# EAGLE design 2layer_v1 (EAGLE 9.2.2)
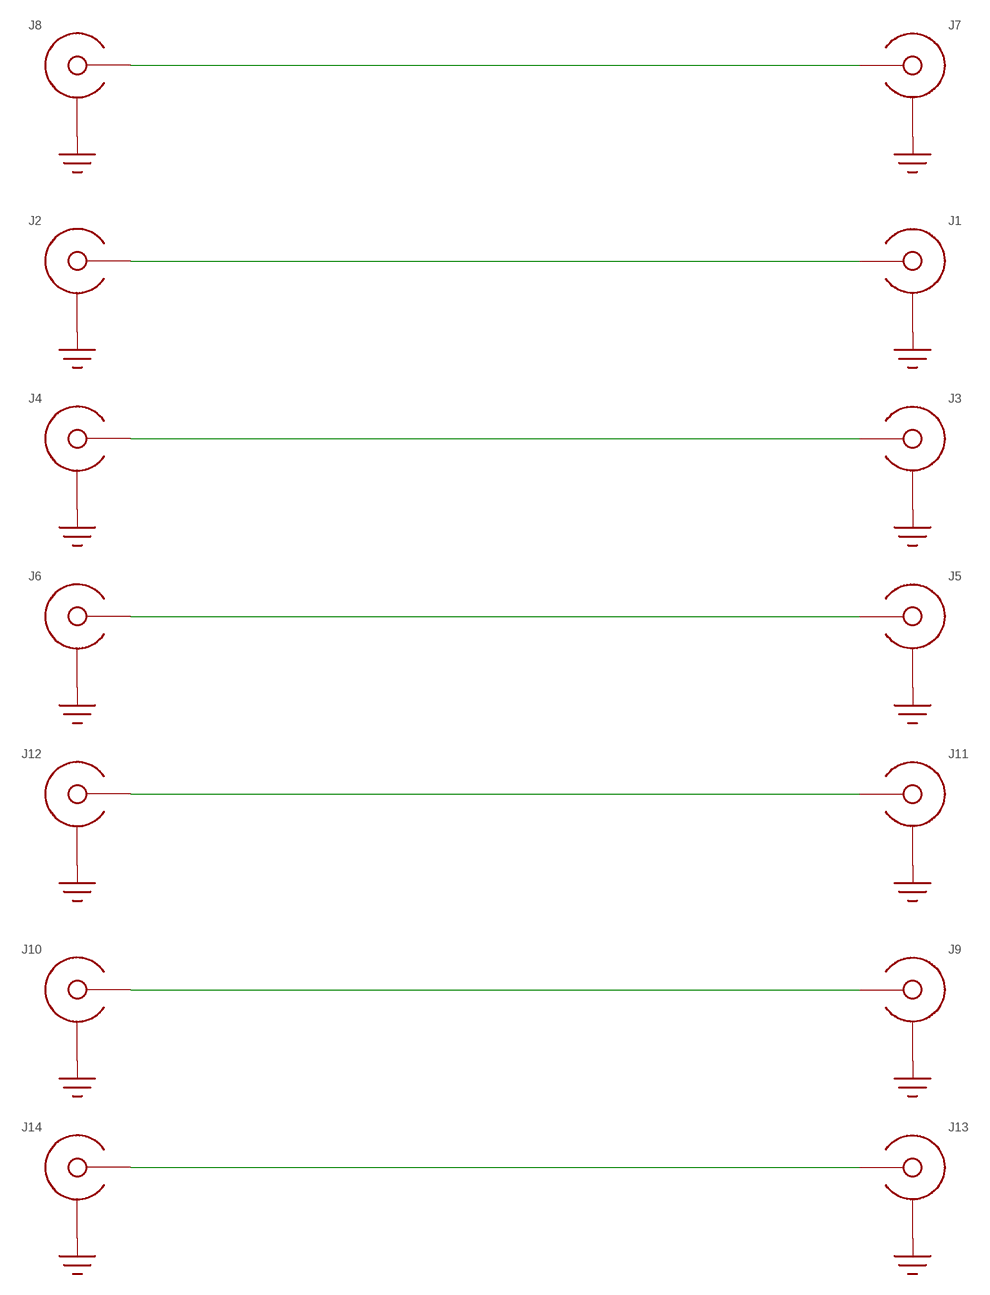
[diagram p0: schematic, sheet 1]

## Parts
J1  SMA_END_LAUNCH2L  [SMA_EDGE_LAUNCH_2L]
J2  SMA_END_LAUNCH2L  [SMA_EDGE_LAUNCH_2L]
J3  SMA_END_LAUNCH2L  [SMA_EDGE_LAUNCH_2L]
J4  SMA_END_LAUNCH2L  [SMA_EDGE_LAUNCH_2L]
J5  SMA_END_LAUNCH2L  [SMA_EDGE_LAUNCH_2L]
J6  SMA_END_LAUNCH2L  [SMA_EDGE_LAUNCH_2L]
J7  SMA_END_LAUNCH2L  [SMA_EDGE_LAUNCH_2L]
J8  SMA_END_LAUNCH2L  [SMA_EDGE_LAUNCH_2L]
J9  SMA_END_LAUNCH2L  [SMA_EDGE_LAUNCH_2L]
J10  SMA_END_LAUNCH2L  [SMA_EDGE_LAUNCH_2L]
J11  SMA_END_LAUNCH2L  [SMA_EDGE_LAUNCH_2L]
J12  SMA_END_LAUNCH2L  [SMA_EDGE_LAUNCH_2L]
J13  SMA_END_LAUNCH2L  [SMA_EDGE_LAUNCH_2L]
J14  SMA_END_LAUNCH2L  [SMA_EDGE_LAUNCH_2L]

## Nets
GND: J1.BOTTOM_GND(SHIELD) J1.GND@1(SHIELD) J1.GND@2(SHIELD) J1.GND@3(SHIELD) J1.GND@4(SHIELD) J1.GND@5(SHIELD) J1.GND@6(SHIELD) J1.GND@7(SHIELD) J1.GND@8(SHIELD) J1.GND@11(SHIELD) J1.GND@12(SHIELD) J1.GND@14(SHIELD) J1.GND@15(SHIELD) J1.GND@16(SHIELD) J1.GND@17(SHIELD) J1.GND_PAD1(SHIELD) J1.GND_PAD2(SHIELD) J2.BOTTOM_GND(SHIELD) J2.GND@1(SHIELD) J2.GND@2(SHIELD) J2.GND@3(SHIELD) J2.GND@4(SHIELD) J2.GND@5(SHIELD) J2.GND@6(SHIELD) J2.GND@7(SHIELD) J2.GND@8(SHIELD) J2.GND@11(SHIELD) J2.GND@12(SHIELD) J2.GND@14(SHIELD) J2.GND@15(SHIELD) J2.GND@16(SHIELD) J2.GND@17(SHIELD) J2.GND_PAD1(SHIELD) J2.GND_PAD2(SHIELD) J3.BOTTOM_GND(SHIELD) J3.GND@1(SHIELD) J3.GND@2(SHIELD) J3.GND@3(SHIELD) J3.GND@4(SHIELD) J3.GND@5(SHIELD) J3.GND@6(SHIELD) J3.GND@7(SHIELD) J3.GND@8(SHIELD) J3.GND@11(SHIELD) J3.GND@12(SHIELD) J3.GND@14(SHIELD) J3.GND@15(SHIELD) J3.GND@16(SHIELD) J3.GND@17(SHIELD) J3.GND_PAD1(SHIELD) J3.GND_PAD2(SHIELD) J4.BOTTOM_GND(SHIELD) J4.GND@1(SHIELD) J4.GND@2(SHIELD) J4.GND@3(SHIELD) J4.GND@4(SHIELD) J4.GND@5(SHIELD) J4.GND@6(SHIELD) J4.GND@7(SHIELD) J4.GND@8(SHIELD) J4.GND@11(SHIELD) J4.GND@12(SHIELD) J4.GND@14(SHIELD) J4.GND@15(SHIELD) J4.GND@16(SHIELD) J4.GND@17(SHIELD) J4.GND_PAD1(SHIELD) J4.GND_PAD2(SHIELD) J5.BOTTOM_GND(SHIELD) J5.GND@1(SHIELD) J5.GND@2(SHIELD) J5.GND@3(SHIELD) J5.GND@4(SHIELD) J5.GND@5(SHIELD) J5.GND@6(SHIELD) J5.GND@7(SHIELD) J5.GND@8(SHIELD) J5.GND@11(SHIELD) J5.GND@12(SHIELD) J5.GND@14(SHIELD) J5.GND@15(SHIELD) J5.GND@16(SHIELD) J5.GND@17(SHIELD) J5.GND_PAD1(SHIELD) J5.GND_PAD2(SHIELD) J6.BOTTOM_GND(SHIELD) J6.GND@1(SHIELD) J6.GND@2(SHIELD) J6.GND@3(SHIELD) J6.GND@4(SHIELD) J6.GND@5(SHIELD) J6.GND@6(SHIELD) J6.GND@7(SHIELD) J6.GND@8(SHIELD) J6.GND@11(SHIELD) J6.GND@12(SHIELD) J6.GND@14(SHIELD) J6.GND@15(SHIELD) J6.GND@16(SHIELD) J6.GND@17(SHIELD) J6.GND_PAD1(SHIELD) J6.GND_PAD2(SHIELD) J7.BOTTOM_GND(SHIELD) J7.GND@1(SHIELD) J7.GND@2(SHIELD) J7.GND@3(SHIELD) J7.GND@4(SHIELD) J7.GND@5(SHIELD) J7.GND@6(SHIELD) J7.GND@7(SHIELD) J7.GND@8(SHIELD) J7.GND@11(SHIELD) J7.GND@12(SHIELD) J7.GND@14(SHIELD) J7.GND@15(SHIELD) J7.GND@16(SHIELD) J7.GND@17(SHIELD) J7.GND_PAD1(SHIELD) J7.GND_PAD2(SHIELD) J8.BOTTOM_GND(SHIELD) J8.GND@1(SHIELD) J8.GND@2(SHIELD) J8.GND@3(SHIELD) J8.GND@4(SHIELD) J8.GND@5(SHIELD) J8.GND@6(SHIELD) J8.GND@7(SHIELD) J8.GND@8(SHIELD) J8.GND@11(SHIELD) J8.GND@12(SHIELD) J8.GND@14(SHIELD) J8.GND@15(SHIELD) J8.GND@16(SHIELD) J8.GND@17(SHIELD) J8.GND_PAD1(SHIELD) J8.GND_PAD2(SHIELD) J9.BOTTOM_GND(SHIELD) J9.GND@1(SHIELD) J9.GND@2(SHIELD) J9.GND@3(SHIELD) J9.GND@4(SHIELD) J9.GND@5(SHIELD) J9.GND@6(SHIELD) J9.GND@7(SHIELD) J9.GND@8(SHIELD) J9.GND@11(SHIELD) J9.GND@12(SHIELD) J9.GND@14(SHIELD) J9.GND@15(SHIELD) J9.GND@16(SHIELD) J9.GND@17(SHIELD) J9.GND_PAD1(SHIELD) J9.GND_PAD2(SHIELD) J10.BOTTOM_GND(SHIELD) J10.GND@1(SHIELD) J10.GND@2(SHIELD) J10.GND@3(SHIELD) J10.GND@4(SHIELD) J10.GND@5(SHIELD) J10.GND@6(SHIELD) J10.GND@7(SHIELD) J10.GND@8(SHIELD) J10.GND@11(SHIELD) J10.GND@12(SHIELD) J10.GND@14(SHIELD) J10.GND@15(SHIELD) J10.GND@16(SHIELD) J10.GND@17(SHIELD) J10.GND_PAD1(SHIELD) J10.GND_PAD2(SHIELD) J11.BOTTOM_GND(SHIELD) J11.GND@1(SHIELD) J11.GND@2(SHIELD) J11.GND@3(SHIELD) J11.GND@4(SHIELD) J11.GND@5(SHIELD) J11.GND@6(SHIELD) J11.GND@7(SHIELD) J11.GND@8(SHIELD) J11.GND@11(SHIELD) J11.GND@12(SHIELD) J11.GND@14(SHIELD) J11.GND@15(SHIELD) J11.GND@16(SHIELD) J11.GND@17(SHIELD) J11.GND_PAD1(SHIELD) J11.GND_PAD2(SHIELD) J12.BOTTOM_GND(SHIELD) J12.GND@1(SHIELD) J12.GND@2(SHIELD) J12.GND@3(SHIELD) J12.GND@4(SHIELD) J12.GND@5(SHIELD) J12.GND@6(SHIELD) J12.GND@7(SHIELD) J12.GND@8(SHIELD) J12.GND@11(SHIELD) J12.GND@12(SHIELD) J12.GND@14(SHIELD) J12.GND@15(SHIELD) J12.GND@16(SHIELD) J12.GND@17(SHIELD) J12.GND_PAD1(SHIELD) J12.GND_PAD2(SHIELD) J13.BOTTOM_GND(SHIELD) J13.GND@1(SHIELD) J13.GND@2(SHIELD) J13.GND@3(SHIELD) J13.GND@4(SHIELD) J13.GND@5(SHIELD) J13.GND@6(SHIELD) J13.GND@7(SHIELD) J13.GND@8(SHIELD) J13.GND@11(SHIELD) J13.GND@12(SHIELD) J13.GND@14(SHIELD) J13.GND@15(SHIELD) J13.GND@16(SHIELD) J13.GND@17(SHIELD) J13.GND_PAD1(SHIELD) J13.GND_PAD2(SHIELD) J14.BOTTOM_GND(SHIELD) J14.GND@1(SHIELD) J14.GND@2(SHIELD) J14.GND@3(SHIELD) J14.GND@4(SHIELD) J14.GND@5(SHIELD) J14.GND@6(SHIELD) J14.GND@7(SHIELD) J14.GND@8(SHIELD) J14.GND@11(SHIELD) J14.GND@12(SHIELD) J14.GND@14(SHIELD) J14.GND@15(SHIELD) J14.GND@16(SHIELD) J14.GND@17(SHIELD) J14.GND_PAD1(SHIELD) J14.GND_PAD2(SHIELD)
N$1: J1.CENTER@1(CENTER) J2.CENTER@1(CENTER)
N$2: J3.CENTER@1(CENTER) J4.CENTER@1(CENTER)
N$3 [41-8]: J5.CENTER@1(CENTER) J6.CENTER@1(CENTER)
N$4 [41-8]: J7.CENTER@1(CENTER) J8.CENTER@1(CENTER)
N$5 [32-6]: J9.CENTER@1(CENTER) J10.CENTER@1(CENTER)
N$6 [32-6]: J11.CENTER@1(CENTER) J12.CENTER@1(CENTER)
N$7 [41-8]: J13.CENTER@1(CENTER) J14.CENTER@1(CENTER)

## Library data of the parts
J1-J14 = yapo:SMA_END_LAUNCH

## Net classes
1 41-8: width 1.041 mm, clearance 0.203 mm
2 32-6: width 0.813 mm, clearance 0.152 mm
3 misc-8: clearance 0.203 mm

## Board
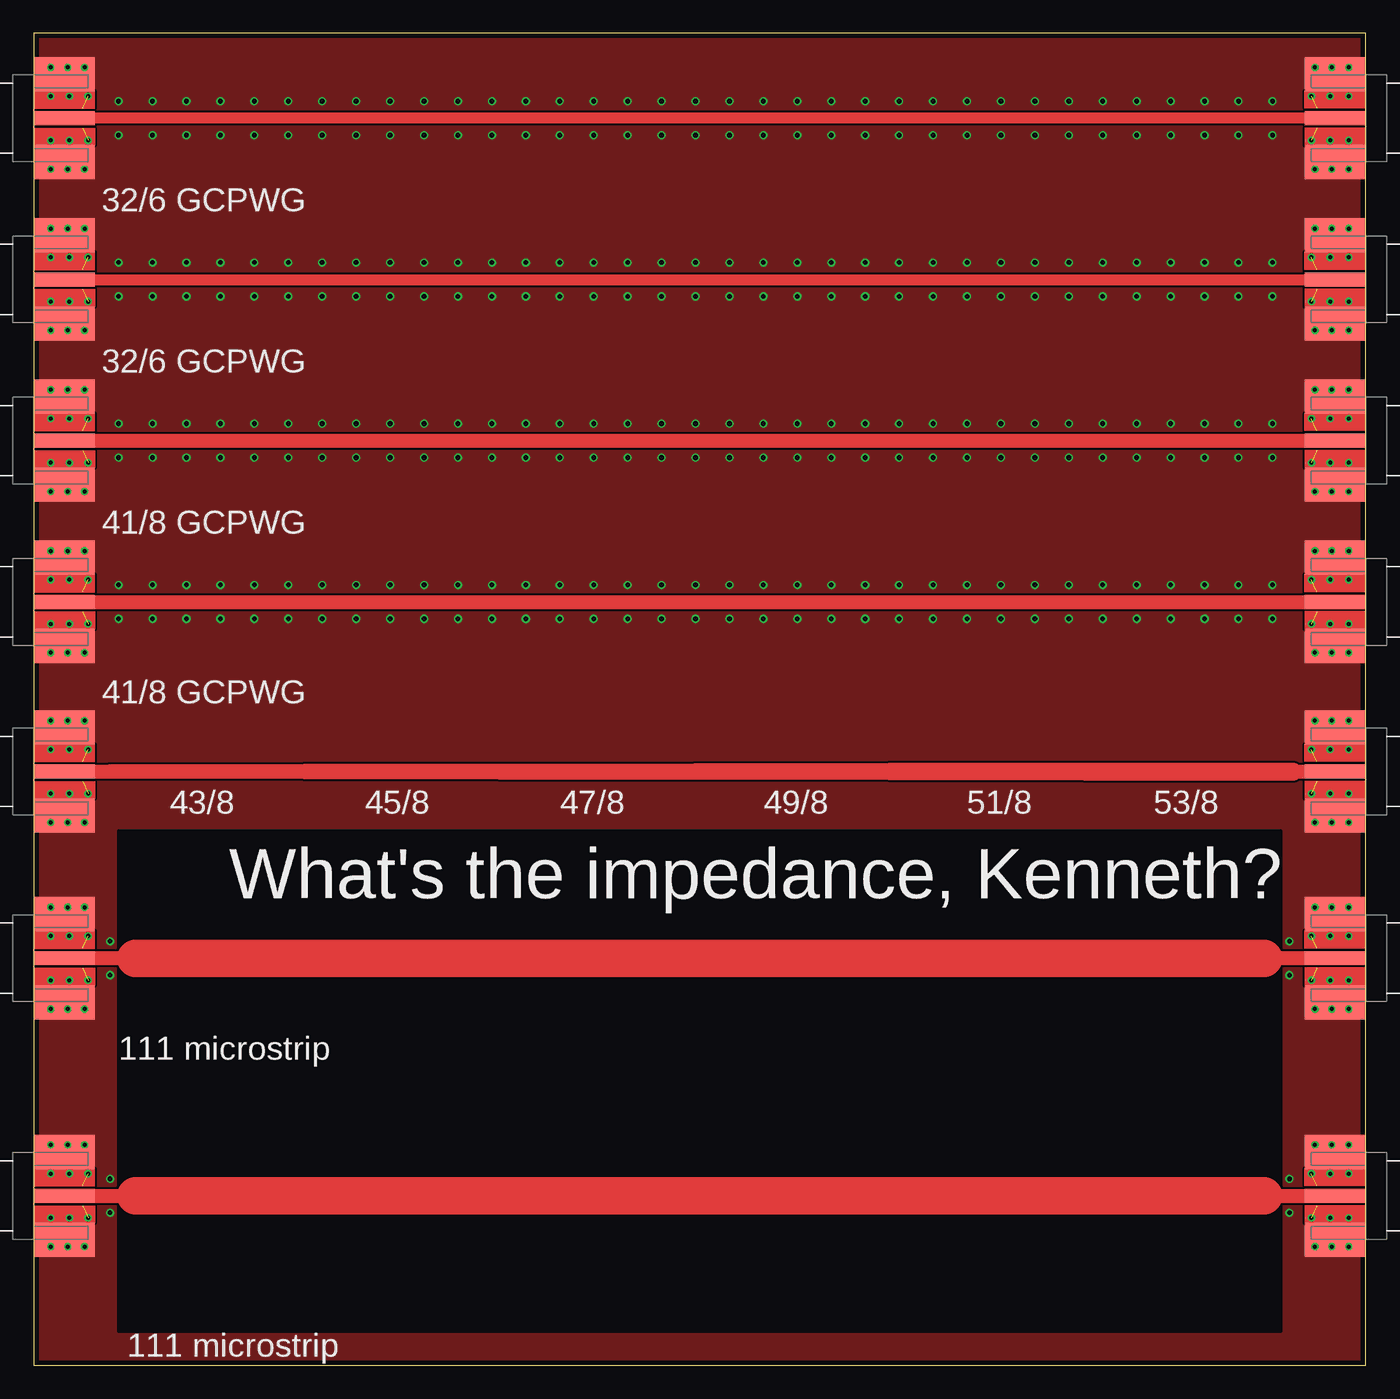
[diagram p1: board, top side]
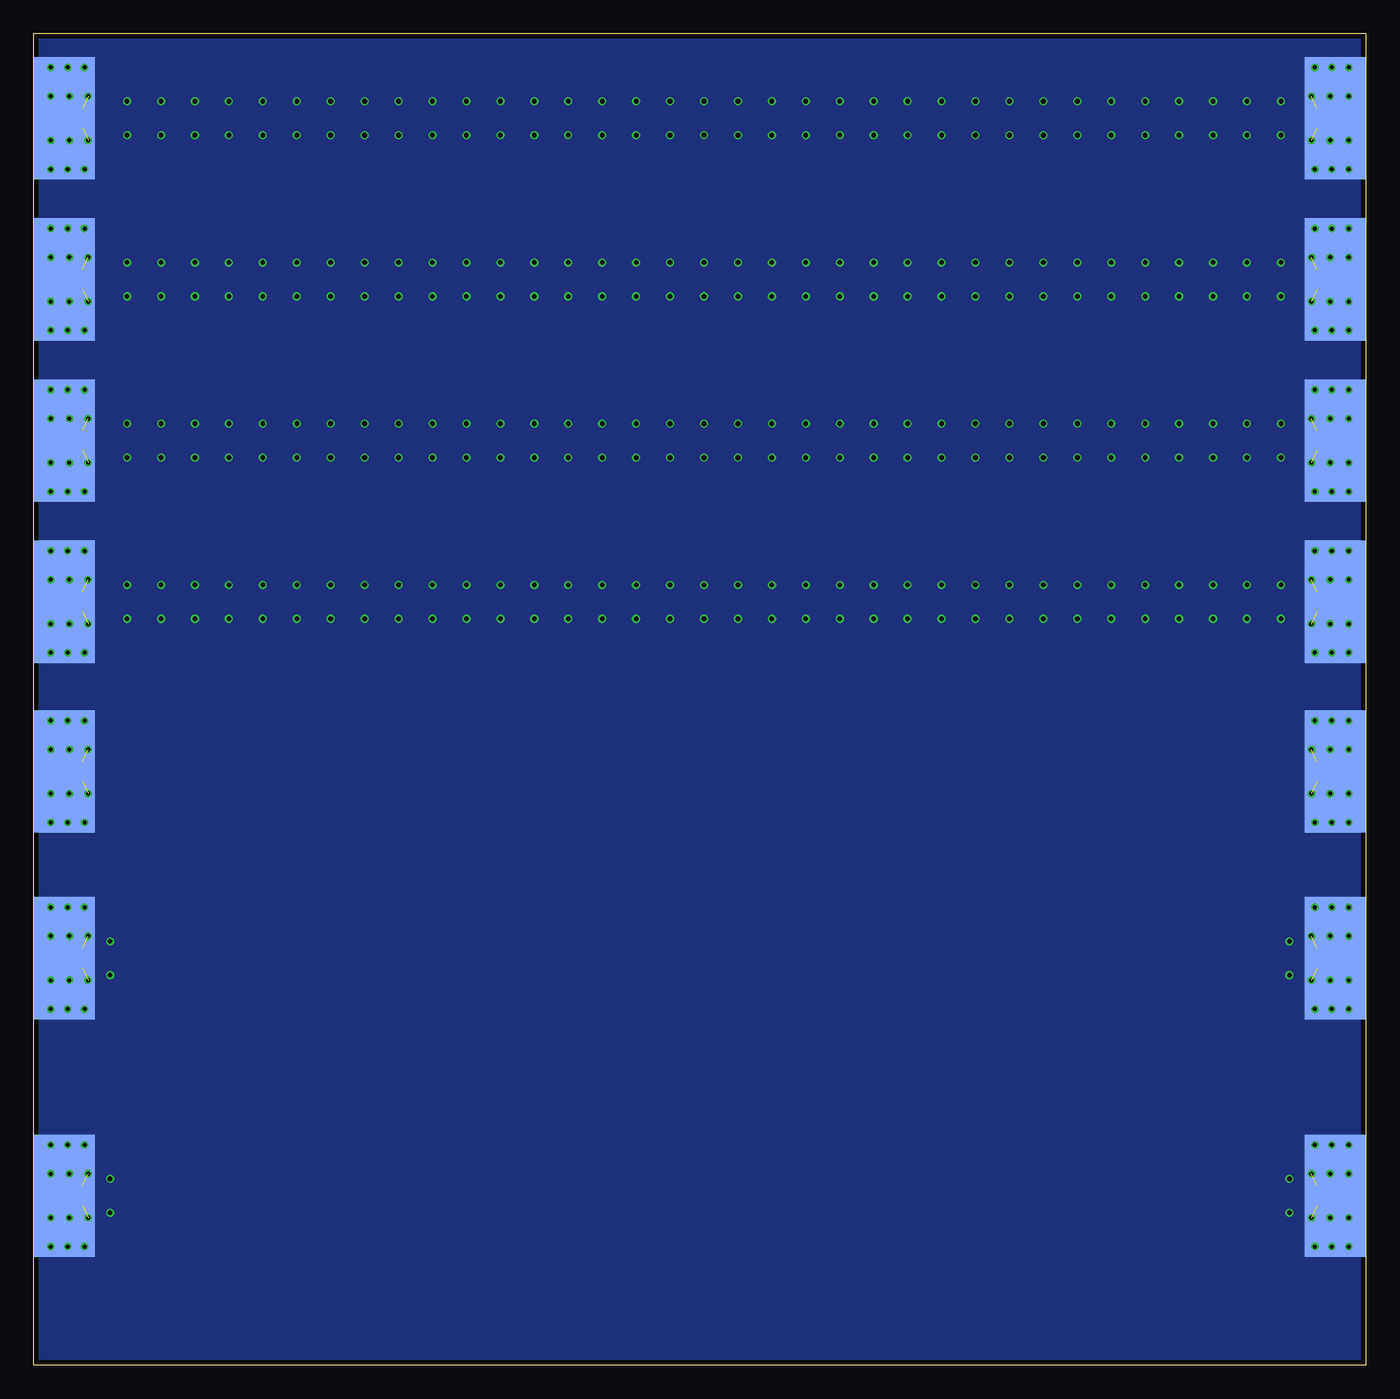
[diagram p2: board, bottom side, seen from below]

Size 99.69 x 99.69 mm. Coordinates in mm from the lower left corner, seen from the top.
Outline: 0,0 99.69,0 99.69,99.69 0,99.69 0,0
Copper layers (1*16): Top 0.035559375mm / dielectric 1.6mm / Bottom 0.035559375mm
Design rules "oshpark-2layer": minimum track width 6mil, minimum drill 10mil, track to track 6mil, track to pad 6mil, pad to pad 6mil, via to via 6mil, smd to smd 6mil, copper to edge 15mil, drill to drill 6mil, minimum pad ring 5mil, minimum via ring 5mil, stop-mask expansion 2.5mil, vias tented up to drill 0mil, thermal gap 10mil
tRestrict: area 6.3,2.5 to 93.3,40

### Footprints (pad centres in the part's own frame; a part is rotated, then mirrored left to right if it is on the bottom)
SMA_EDGE_LAUNCH_2L = smd 4.572 x 9.144 bottom: BOTTOM_GND 2.286,0 | smd 4.572 x 1.041: CENTER@1 2.286,0 | drill 0.3: GND@1 1.27,3.81; GND@2 3.81,3.81; GND@3 1.27,1.651; GND@4 4.064,1.651; GND@5 1.27,-1.651; GND@6 4.064,-1.651; GND@7 1.27,-3.81; GND@8 3.81,-3.81; GND@14 2.54,3.81; GND@15 2.54,-3.81; GND@16 2.667,-1.651; GND@17 2.667,1.651 | smd 0.051 x 0.051: GND@11 3.683,0.762; GND@12 3.683,-0.762 | smd 4.572 x 2.54: GND_PAD1 2.286,3.302; GND_PAD2 2.286,-3.302

### Placement (x,y rotation side)
J1  99.69,12.7 180 top
J2  0,12.7 0 top
J3  99.69,30.48 180 top
J4  0,30.48 0 top
J5  99.69,57.15 180 top
J6  0,57.15 0 top
J7  99.69,69.22 180 top
J8  0,69.22 0 top
J9  0,81.28 0 top
J10  99.69,81.28 180 top
J11  0,93.34 0 top
J12  99.69,93.34 180 top
J13  0,44.45 0 top
J14  99.69,44.45 180 top

### Tracks (layer width: path | path; a pad name or v marks a point on that pad's centre or on a via)
GND  (via drill 0.35)  (28 unrouted)
  other vias: 5.71,13.97 5.71,11.43 93.98,13.97 93.98,11.43 5.71,29.21 5.71,31.75 93.98,29.21 93.98,31.75 6.35,58.42 8.89,58.42 11.43,58.42 13.97,58.42 16.51,58.42 19.05,58.42 21.59,58.42 24.13,58.42 26.67,58.42 29.21,58.42 31.75,58.42 34.29,58.42 36.83,58.42 39.37,58.42 41.91,58.42 44.45,58.42 46.99,58.42 49.53,58.42 52.07,58.42 54.61,58.42 57.15,58.42 59.69,58.42 62.23,58.42 64.77,58.42 67.31,58.42 69.85,58.42 72.39,58.42 74.93,58.42 77.47,58.42 80.01,58.42 82.55,58.42 85.09,58.42 87.63,58.42 90.17,58.42 92.71,58.42 6.35,55.88 8.89,55.88 11.43,55.88 13.97,55.88 16.51,55.88 19.05,55.88 21.59,55.88 24.13,55.88 26.67,55.88 29.21,55.88 31.75,55.88 34.29,55.88 36.83,55.88 39.37,55.88 41.91,55.88 44.45,55.88 46.99,55.88 49.53,55.88 52.07,55.88 54.61,55.88 57.15,55.88 59.69,55.88 62.23,55.88 64.77,55.88 67.31,55.88 69.85,55.88 72.39,55.88 74.93,55.88 77.47,55.88 80.01,55.88 82.55,55.88 85.09,55.88 87.63,55.88 90.17,55.88 92.71,55.88 6.35,70.48 8.89,70.48 11.43,70.48 13.97,70.48 16.51,70.48 19.05,70.48 21.59,70.48 24.13,70.48 26.67,70.48 29.21,70.48 31.75,70.48 34.29,70.48 36.83,70.48 39.37,70.48 41.91,70.48 44.45,70.48 46.99,70.48 49.53,70.48 52.07,70.48 54.61,70.48 57.15,70.48 59.69,70.48 62.23,70.48 64.77,70.48 67.31,70.48 69.85,70.48 72.39,70.48 74.93,70.48 77.47,70.48 80.01,70.48 82.55,70.48 85.09,70.48 87.63,70.48 90.17,70.48 92.71,70.48 6.35,67.94 8.89,67.94 11.43,67.94 13.97,67.94 16.51,67.94 19.05,67.94 21.59,67.94 24.13,67.94 26.67,67.94 29.21,67.94 31.75,67.94 34.29,67.94 36.83,67.94 39.37,67.94 41.91,67.94 44.45,67.94 46.99,67.94 49.53,67.94 52.07,67.94 54.61,67.94 57.15,67.94 59.69,67.94 62.23,67.94 64.77,67.94 67.31,67.94 69.85,67.94 72.39,67.94 74.93,67.94 77.47,67.94 80.01,67.94 82.55,67.94 85.09,67.94 87.63,67.94 90.17,67.94 92.71,67.94 6.35,82.55 8.89,82.55 11.43,82.55 13.97,82.55 16.51,82.55 19.05,82.55 21.59,82.55 24.13,82.55 26.67,82.55 29.21,82.55 31.75,82.55 34.29,82.55 36.83,82.55 39.37,82.55 41.91,82.55 44.45,82.55 46.99,82.55 49.53,82.55 52.07,82.55 54.61,82.55 57.15,82.55 59.69,82.55 62.23,82.55 64.77,82.55 67.31,82.55 69.85,82.55 72.39,82.55 74.93,82.55 77.47,82.55 80.01,82.55 82.55,82.55 85.09,82.55 87.63,82.55 90.17,82.55 92.71,82.55 6.35,80.01 8.89,80.01 11.43,80.01 13.97,80.01 16.51,80.01 19.05,80.01 21.59,80.01 24.13,80.01 26.67,80.01 29.21,80.01 31.75,80.01 34.29,80.01 36.83,80.01 39.37,80.01 41.91,80.01 44.45,80.01 46.99,80.01 49.53,80.01 52.07,80.01 54.61,80.01 57.15,80.01 59.69,80.01 62.23,80.01 64.77,80.01 67.31,80.01 69.85,80.01 72.39,80.01 74.93,80.01 77.47,80.01 80.01,80.01 82.55,80.01 85.09,80.01 87.63,80.01 90.17,80.01 92.71,80.01 6.35,92.08 8.89,92.08 11.43,92.08 13.97,92.08 16.51,92.08 19.05,92.08 21.59,92.08 24.13,92.08 26.67,92.08 29.21,92.08 31.75,92.08 34.29,92.08 36.83,92.08 39.37,92.08 41.91,92.08 44.45,92.08 46.99,92.08 49.53,92.08 52.07,92.08 54.61,92.08 57.15,92.08 59.69,92.08 62.23,92.08 64.77,92.08 67.31,92.08 69.85,92.08 72.39,92.08 74.93,92.08 77.47,92.08 80.01,92.08 82.55,92.08 85.09,92.08 87.63,92.08 90.17,92.08 92.71,92.08 6.35,94.61 8.89,94.61 11.43,94.61 13.97,94.61 16.51,94.61 19.05,94.61 21.59,94.61 24.13,94.61 26.67,94.61 29.21,94.61 31.75,94.61 34.29,94.61 36.83,94.61 39.37,94.61 41.91,94.61 44.45,94.61 46.99,94.61 49.53,94.61 52.07,94.61 54.61,94.61 57.15,94.61 59.69,94.61 62.23,94.61 64.77,94.61 67.31,94.61 69.85,94.61 72.39,94.61 74.93,94.61 77.47,94.61 80.01,94.61 82.55,94.61 85.09,94.61 87.63,94.61 90.17,94.61 92.71,94.61
  pour Top (no thermals): 0,0 99.69,0 99.69,99.69 0,99.69
  pour Bottom (no thermals): 0,0 99.69,0 99.69,99.69 0,99.69
N$1
  Top 1.041: J2.CENTER@1 7.62,12.7 | 92.08,12.7 J1.CENTER@1
  Top 2.819: 7.62,12.7 92.08,12.7
N$2
  Top 1.041: 7.62,30.48 J4.CENTER@1 | J3.CENTER@1 92.08,30.48
  Top 2.819: 92.08,30.48 7.62,30.48
N$3
  Top 1.041: J6.CENTER@1 J5.CENTER@1
N$4
  Top 1.041: J8.CENTER@1 J7.CENTER@1
N$5
  Top 0.813: J9.CENTER@1 J10.CENTER@1
N$6
  Top 0.813: J12.CENTER@1 J11.CENTER@1
N$7
  Top 1.041: J13.CENTER@1 5.71,44.45 | 94.23,44.45 J14.CENTER@1
  Top 1.092: 5.71,44.45 20.32,44.45
  Top 1.143: 20.32,44.45 34.92,44.45
  Top 1.194: 34.92,44.45 49.53,44.45
  Top 1.245: 49.53,44.45 64.14,44.45
  Top 1.295: 64.14,44.45 78.74,44.45
  Top 1.346: 78.74,44.45 94.23,44.45

### Text on the board
tPlace: 32/6 GCPWG | 32/6 GCPWG | 41/8 GCPWG | 41/8 GCPWG | 43/8 | 45/8 | 47/8 | 49/8 | 51/8 | 53/8 | What's the impedance, Kenneth? | 111 microstrip | 111 microstrip